# Altium project fibrance_drivers.PrjPcb
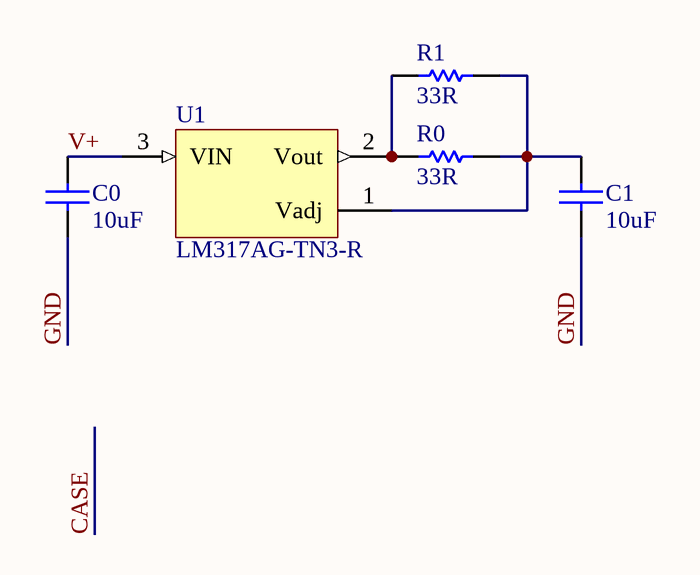
[diagram p0: red.SchDoc]
1 sheet, 5 parts. Net scope: global (net labels, ports and power ports of the same name join across sheets).
Board files: red.PcbDoc, bottom.PcbDoc

## Sheet red.SchDoc
size A

### Parts
C0  value 10uF  [C_0805]  (hidden comment: CL21A106KAYNNNE)
C1  value 10uF  [C_0805]  (hidden comment: CL21A106KAYNNNE)
R0  value 33R  [R_0805]  (hidden comment: 0805W8F330JT5E)
R1  value 33R  [R_0805]  (hidden comment: 0805W8F330JT5E)
U1  LM317AG-TN3-R  [TO-252AA]

### Nets
GND: C0.1 C1.1
V+: C0.2 U1.3(VIN)
NetC1_2: C1.2 R0.2 R1.2 U1.1(Vadj)
NetR0_1: R0.1 R1.1 U1.2(Vout)

### Library data of the parts
C0 C1 = CL21A106KAYNNNE: C - CAPACITOR - MLCC - 10uF - 25V - 0805; WVDC: 25; LCSC Part #: C15850; Availability: Basic
R0 R1 = 0805W8F330JT5E: R - RESISTOR - SMD - 33R - 1% - 0402; LCSC Part #: C17634; JLC Availability: Basic
U1 = LM317AG-TN3-R: U - IC - ADJUSTABLE LDO; VOut: ADJ; LCSC Part #: C75510; JLC Availability: Basic

## Assembly variants
F4: not fitted MCU_J_C MCU_J_D MCU_U_B MCU_U_D
F1: not fitted MCU_J_C MCU_J_D MCU_U_A MCU_U_D
F4_USB_ONLY: not fitted MCU_ETH_C_A MCU_ETH_C_B MCU_ETH_C_C MCU_ETH_C_D MCU_ETH_C_E MCU_ETH_C_F MCU_ETH_C_G MCU_ETH_C_H MCU_ETH_C_I MCU_ETH_C_J MCU_ETH_C_K MCU_ETH_C_L MCU_ETH_C_M MCU_ETH_C_O MCU_ETH_C_P MCU_ETH_C_Q MCU_ETH_C_R MCU_ETH_C_S MCU_ETH_C_T MCU_ETH_D_A MCU_ETH_D_B MCU_ETH_D_C MCU_ETH_D_D MCU_ETH_D_E MCU_ETH_D_F MCU_ETH_D_G MCU_ETH_D_H MCU_ETH_L_A MCU_ETH_NT_A MCU_ETH_NT_B MCU_ETH_NT_C MCU_ETH_NT_D MCU_ETH_NT_E MCU_ETH_R_A MCU_ETH_R_B MCU_ETH_R_C MCU_ETH_R_D MCU_ETH_R_E MCU_ETH_R_F MCU_ETH_R_G MCU_ETH_R_H MCU_ETH_R_I MCU_ETH_R_J MCU_ETH_R_K MCU_ETH_R_L MCU_ETH_R_M MCU_ETH_R_N MCU_ETH_R_O MCU_ETH_T_A MCU_J_B MCU_J_C MCU_J_E MCU_U_B MCU_U_D MCU_U_E MCU_U_F MCU_Y_B